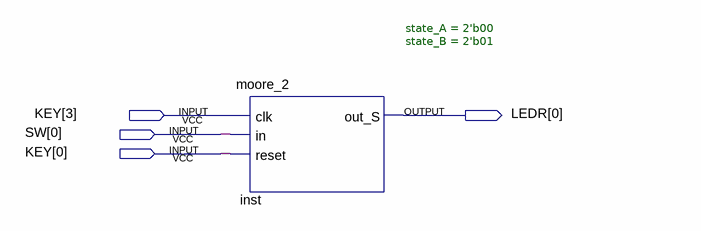
[diagram p0: schematic sheet]
// Quartus schematic verilogmerda.bdf as structural Verilog: 1 symbols, 4 pins
module verilogmerda (
  input  [3:0] KEY,
  input  [0:0] SW,
  output [0:0] LEDR
);

  moore_2 #(.state_A(2'b00), .state_B(2'b01)) inst (.clk(KEY[3]), .in(SW[0]), .reset(KEY[0]), .out_S(LEDR[0]));
endmodule
